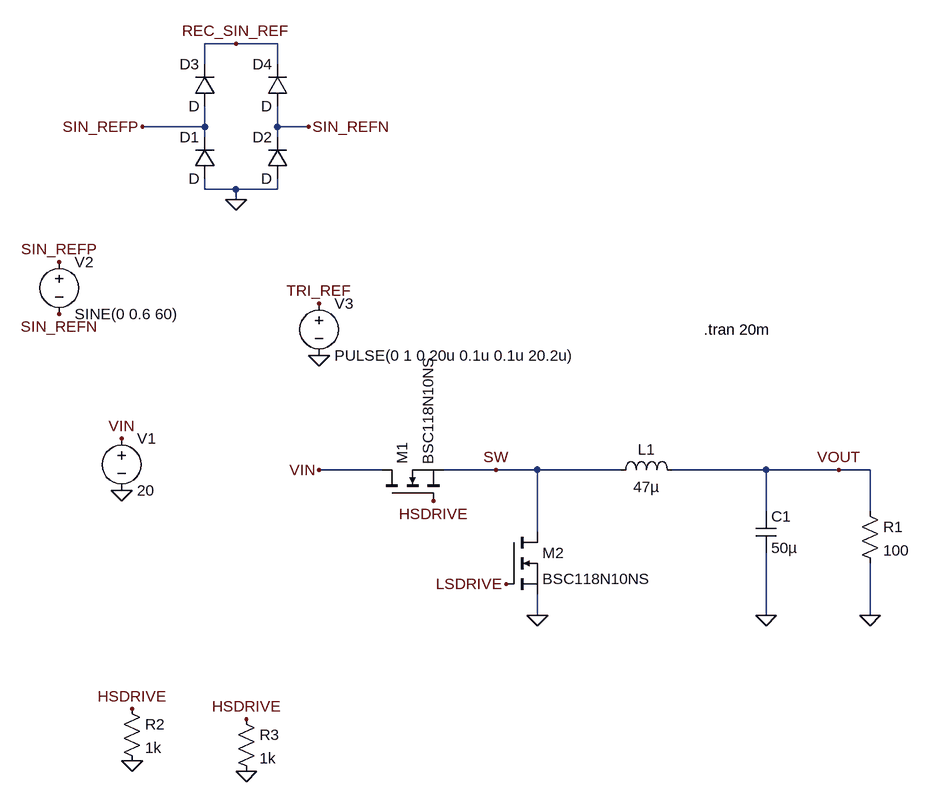
[diagram p0: schematic powertrain.asc]
powertrain.asc, the LTspice schematic file:
Version 4
SHEET 1 880 680
WIRE -240 -608 -288 -608
WIRE -176 -608 -240 -608
WIRE -288 -576 -288 -608
WIRE -176 -576 -176 -608
WIRE -288 -480 -288 -512
WIRE -288 -480 -384 -480
WIRE -176 -480 -176 -512
WIRE -128 -480 -176 -480
WIRE -288 -464 -288 -480
WIRE -176 -464 -176 -480
WIRE -288 -384 -288 -400
WIRE -240 -384 -288 -384
WIRE -176 -384 -176 -400
WIRE -176 -384 -240 -384
WIRE -240 -368 -240 -384
WIRE -16 48 -112 48
WIRE 160 48 80 48
WIRE 224 48 160 48
WIRE 352 48 224 48
WIRE 576 48 432 48
WIRE 688 48 576 48
WIRE 736 48 688 48
WIRE 576 112 576 48
WIRE 736 112 736 48
WIRE 224 144 224 48
WIRE 224 272 224 240
WIRE 576 272 576 176
WIRE 736 272 736 192
FLAG 224 272 0
FLAG 576 272 0
FLAG 736 272 0
FLAG -112 48 VIN
FLAG 64 96 HSDRIVE
FLAG 176 224 LSDRIVE
FLAG 160 48 SW
FLAG 688 48 VOUT
FLAG -416 80 0
FLAG -416 0 VIN
FLAG -112 -128 0
FLAG -112 -208 TRI_REF
FLAG -400 496 0
FLAG -224 512 0
FLAG -400 416 HSDRIVE
FLAG -224 432 HSDRIVE
FLAG -240 -368 0
FLAG -240 -608 REC_SIN_REF
FLAG -384 -480 SIN_REFP
FLAG -128 -480 SIN_REFN
FLAG -512 -272 SIN_REFP
FLAG -512 -192 SIN_REFN
SYMBOL nmos -16 96 R270
SYMATTR InstName M1
SYMATTR Value BSC118N10NS
SYMBOL nmos 176 144 R0
SYMATTR InstName M2
SYMATTR Value BSC118N10NS
SYMBOL ind 336 64 R270
WINDOW 0 32 56 VTop 2
WINDOW 3 5 56 VBottom 2
SYMATTR InstName L1
SYMATTR Value 47µ
SYMBOL cap 560 112 R0
SYMATTR InstName C1
SYMATTR Value 50µ
SYMBOL res 720 96 R0
SYMATTR InstName R1
SYMATTR Value 100
SYMBOL voltage -416 -16 R0
WINDOW 123 0 0 Left 2
WINDOW 39 0 0 Left 2
SYMATTR InstName V1
SYMATTR Value 20
SYMBOL voltage -512 -288 R0
WINDOW 123 0 0 Left 2
WINDOW 39 0 0 Left 2
SYMATTR InstName V2
SYMATTR Value SINE(0 0.6 60)
SYMBOL voltage -112 -224 R0
WINDOW 123 0 0 Left 2
WINDOW 39 0 0 Left 2
SYMATTR InstName V3
SYMATTR Value PULSE(0 1 0 20u 0.1u 0.1u 20.2u)
SYMBOL res -416 400 R0
SYMATTR InstName R2
SYMATTR Value 1k
SYMBOL res -240 416 R0
SYMATTR InstName R3
SYMATTR Value 1k
SYMBOL diode -272 -400 R180
WINDOW 0 24 64 Left 2
WINDOW 3 24 0 Left 2
SYMATTR InstName D1
SYMBOL diode -160 -400 R180
WINDOW 0 24 64 Left 2
WINDOW 3 24 0 Left 2
SYMATTR InstName D2
SYMBOL diode -272 -512 R180
WINDOW 0 24 64 Left 2
WINDOW 3 24 0 Left 2
SYMATTR InstName D3
SYMBOL diode -160 -512 R180
WINDOW 0 24 64 Left 2
WINDOW 3 24 0 Left 2
SYMATTR InstName D4
TEXT 480 -168 Left 2 !.tran 20m

The netlist it stands for:
* powertrain.asc
M1 VIN HSDRIVE SW SW BSC118N10NS
M2 SW LSDRIVE 0 0 BSC118N10NS
L1 SW VOUT 47µ
C1 VOUT 0 50µ
R1 VOUT 0 100
V1 VIN 0 20
V2 SIN_REFP SIN_REFN SINE(0 0.6 60)
V3 TRI_REF 0 PULSE(0 1 0 20u 0.1u 0.1u 20.2u)
R2 HSDRIVE 0 1k
R3 HSDRIVE 0 1k
D1 0 SIN_REFP D
D2 0 SIN_REFN D
D3 SIN_REFP REC_SIN_REF D
D4 SIN_REFN REC_SIN_REF D
.model D D
.lib standard.dio
.model NMOS NMOS
.model PMOS PMOS
.lib standard.mos
.tran 20m
.backanno
.end

* Results of the author's LTspice run, read from the files saved beside the schematic
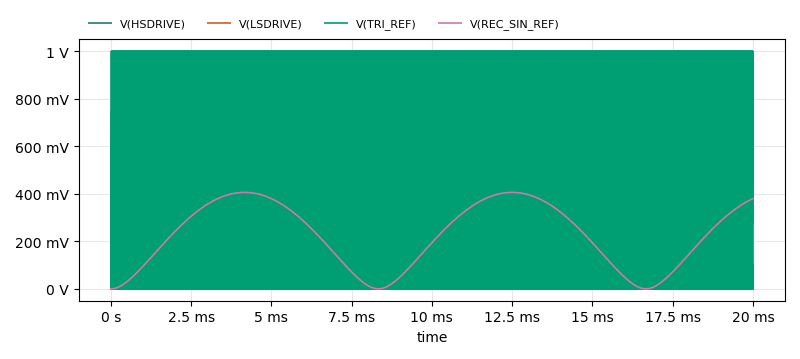
[diagram p1: Transient Analysis of powertrain.asc, plotted from the saved traces]
* Transient Analysis, 1 run:
*   V(HSDRIVE): min -0.1618 fV, max 0.2235 fV, average 0.001192 fV, rms 0.03345 fV, last 0.0001421 fV
*   V(LSDRIVE): min -0.02628 fV, max 0.03805 fV, average 6.835e-05 fV, rms 0.005834 fV, last 0.0004667 fV
*   V(TRI_REF): min 0 V, max 1 V, average 501.7 mV, rms 704.3 mV, last 100 mV
*   V(REC_SIN_REF): min 0 V, max 405.9 mV, average 223.8 mV, rms 262.6 mV, last 379.8 mV